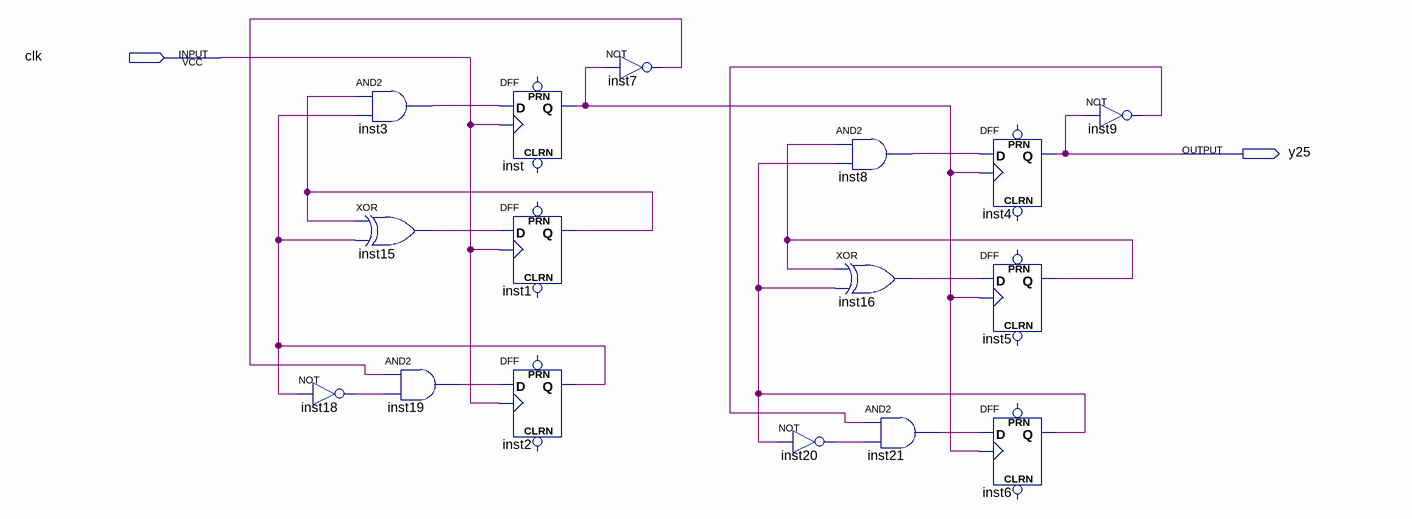
[diagram p0: schematic sheet]
// Quartus schematic 25Xdec.bdf as structural Verilog: 16 symbols, 2 pins
module \25Xdec  (
  input  clk,
  output y25
);

  wire inst1_q, inst2_q, inst3_out, inst5_q, inst6_q, inst7_out, inst8_out, inst9_out, inst15_out,
       inst16_out, inst18_out, inst19_out, inst20_out, inst21_out, inst_q;

  not inst18 (inst18_out, inst2_q);
  and inst3 (inst3_out, inst1_q, inst2_q);
  xor inst15 (inst15_out, inst1_q, inst2_q);
  and inst19 (inst19_out, inst7_out, inst18_out);
  DFF inst (.CLK(clk), .D(inst3_out), .Q(inst_q));  // open: CLRN, PRN
  DFF inst1 (.CLK(clk), .D(inst15_out), .Q(inst1_q));  // open: CLRN, PRN
  DFF inst2 (.CLK(clk), .D(inst19_out), .Q(inst2_q));  // open: CLRN, PRN
  not inst7 (inst7_out, inst_q);
  not inst20 (inst20_out, inst6_q);
  and inst8 (inst8_out, inst5_q, inst6_q);
  xor inst16 (inst16_out, inst5_q, inst6_q);
  and inst21 (inst21_out, inst9_out, inst20_out);
  DFF inst4 (.CLK(inst_q), .D(inst8_out), .Q(y25));  // open: CLRN, PRN
  DFF inst5 (.CLK(inst_q), .D(inst16_out), .Q(inst5_q));  // open: CLRN, PRN
  DFF inst6 (.CLK(inst_q), .D(inst21_out), .Q(inst6_q));  // open: CLRN, PRN
  not inst9 (inst9_out, y25);
endmodule
